# EAGLE design pH-meter-v1-1 (EAGLE 5.11)
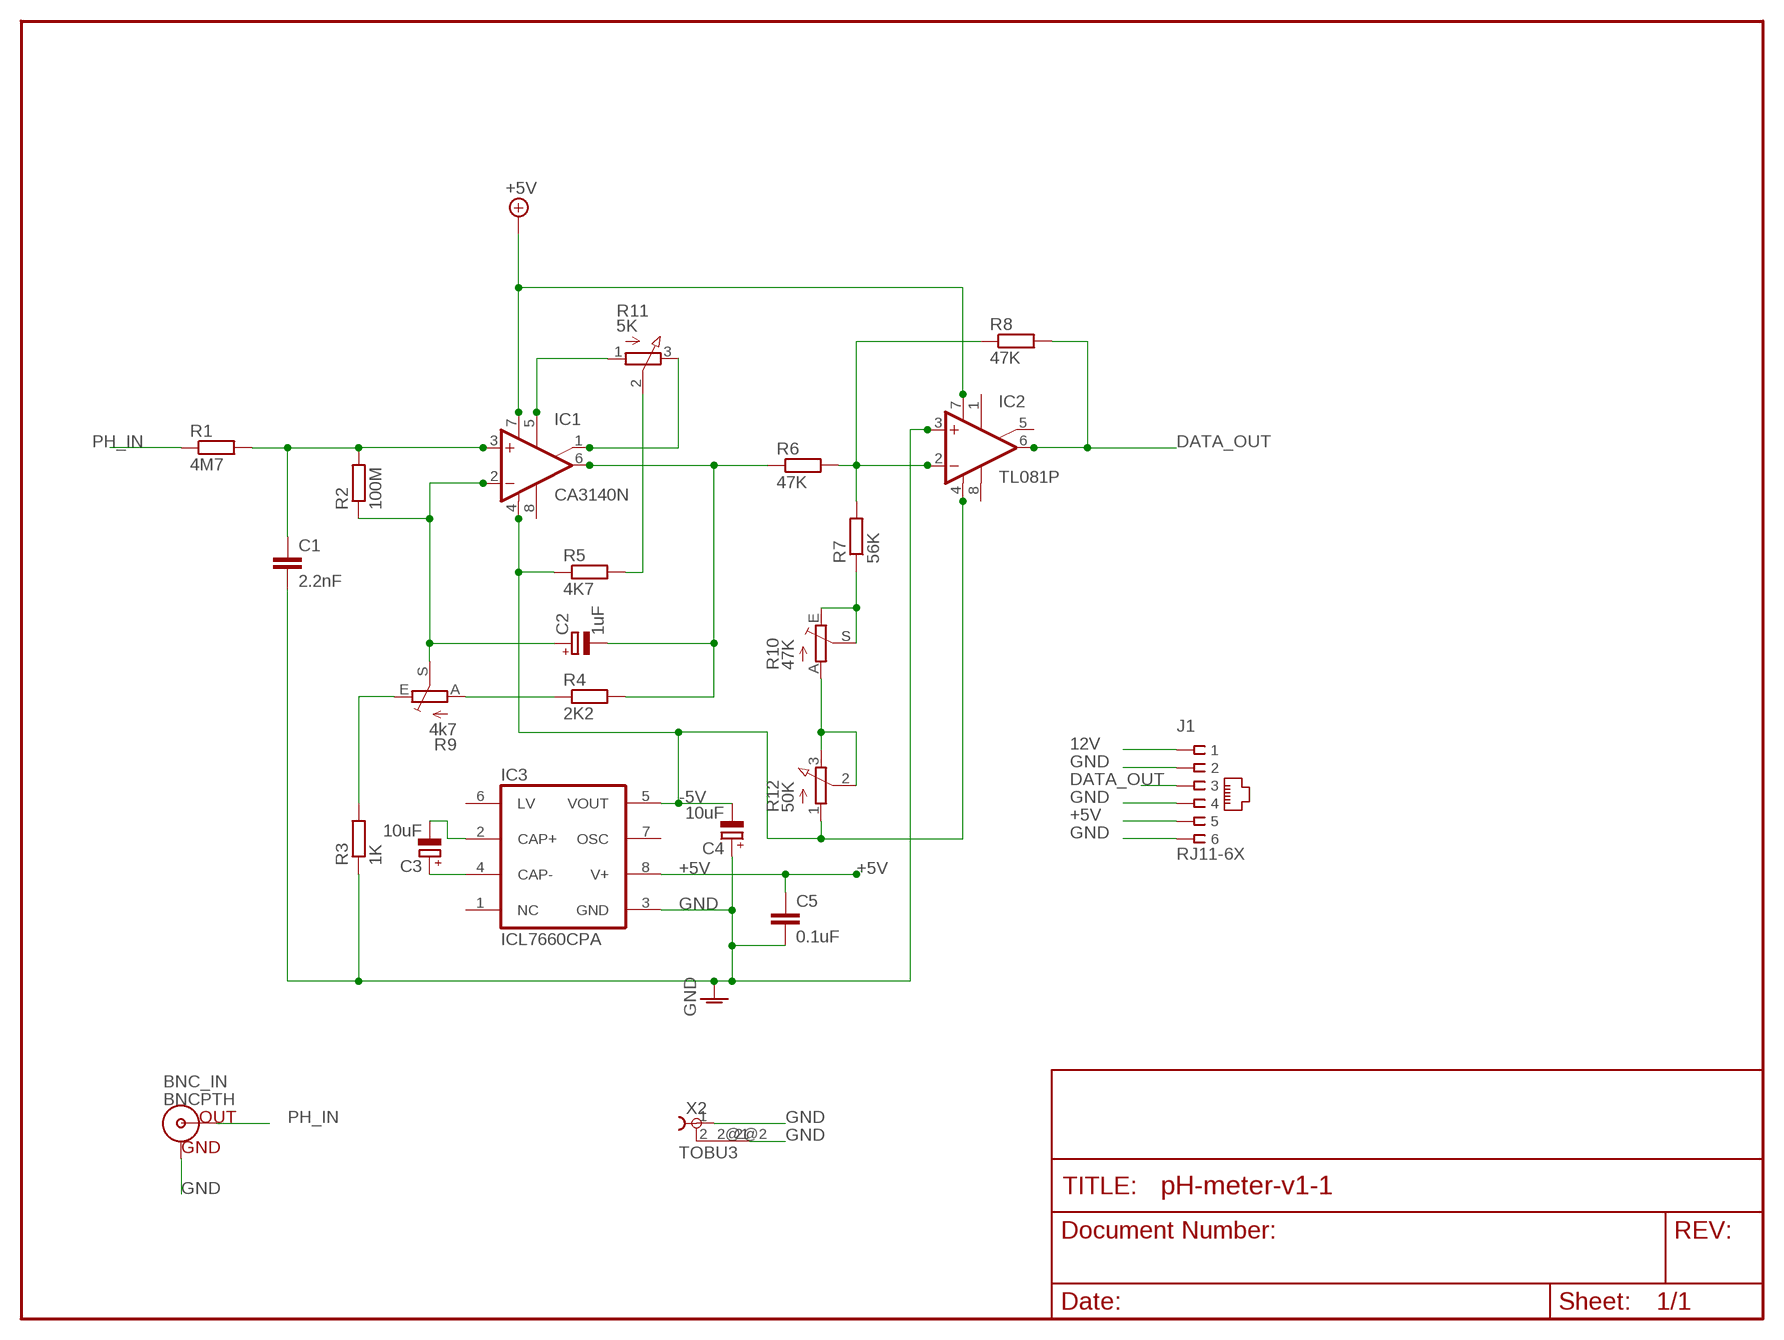
[diagram p0: schematic, sheet 1]

## Parts
BNC_IN  BNCPTH  [BNC]
C1  2.2nF  C-EU025-030X050  [C025-030X050]
C2  1uF  CPOL-EUE2-4  [E2-4]
C3  10uF  CPOL-EUE2-4  [E2-4]
C4  10uF  CPOL-EUE2-4  [E2-4]
C5  0.1uF  C-EU025-030X050  [C025-030X050]
IC1  CA3140N  [DIL08]
IC2  TL081P  [DIL08]
IC3  ICL7660CPA  [DIL08]
J1  RJ11-6X  [RJ11-NO_SHIELD]
R1  4M7  R-EU_0309/12  [0309/12]
R2  100M  R-EU_0309/12  [0309/12]
R3  1K  R-EU_0309/12  [0309/12]
R4  2K2  R-EU_0309/12  [0309/12]
R5  4K7  R-EU_0309/12  [0309/12]
R6  47K  R-EU_0309/12  [0309/12]
R7  56K  R-EU_0309/12  [0309/12]
R8  47K  R-EU_0309/12  [0309/12]
R9  4k7  TRIM_EU-LI15  [LI15]
R10  47K  TRIM_EU-LI15  [LI15]
R11  5K  3RP/1610N  [3RP/1610N]
R12  50K  3RP/1610N  [3RP/1610N]
X2  TOBU3  [TOBU3]

## Nets
12V: J1.1
+5V: C5.1 IC1.7(V+) IC2.7(V+) IC3.8(V+) J1.5
-5V: C4.- IC1.4(V-) IC2.4(V-) IC3.5(VOUT) R5.1 R12.1(A)
DATA_OUT: IC2.6(OUT) J1.3 R8.2
GND: BNC_IN.GND C1.2 C4.+ C5.2 IC2.3(+IN) IC3.3(GND) J1.2 J1.4 J1.6 R3.1 X2.1 X2.2@2
N$1: C1.1 IC1.3(+IN) R1.2 R2.2
N$2: C2.+ IC1.2(-IN) R2.1 R9.S
N$3: R5.2 R11.2(S)
N$4: IC1.5(ON) R11.1(A)
N$5: IC1.1(ON/CMP) R11.3(E)
N$6: C2.- IC1.6(OUT) R4.2 R6.1
N$7: R4.1 R9.A
N$8: R3.2 R9.E
N$9: R7.1 R10.E R10.S
N$10: R10.A R12.2(S) R12.3(E)
N$11: C3.- IC3.2(CAP+)
N$12: IC2.2(-IN) R6.2 R7.2 R8.1
N$13: C3.+ IC3.4(CAP-)
PH_IN: BNC_IN.S(OUT) R1.1
Unconnected: IC1.8(CMP) IC2.1(ON1) IC2.5(ON2) IC2.8(OPT) IC3.1(NC) IC3.6(LV) IC3.7(OSC) X2.2 X2.2@1

## Library data of the parts
BNC_IN = SparkFun:BNC: BNC Connector, Mouser Part# 5227161
C1 C5 = resistor:C-EU: CAPACITOR, European symbol
C2-C4 = resistor:CPOL-EU: POLARIZED CAPACITOR, European symbol
IC1 = linear:CA3140: OP AMP
IC2 = linear:TL081: OP AMP
IC3 = maxim:ICL7660CPA: VOLTAGE CONVERTER; MF: INTERSIL; MPN: ICL7660CPA; OC_FARNELL: 1018170; OC_NEWARK: 06F7441
J1 = con-tycoelectronics:RJ11: CORCOM Modular RJ Jacks No Shield Source: www.tycoelectronics.com .. ENG_DS_1654001_1099_RJ_L_0507.pdf; MPN: RJ11-6X; OC_FARNELL: unknown; OC_NEWARK: 16R6089
R1-R8 = rcl:R-EU_: RESISTOR, European symbol
R9 R10 = pot:TRIM_EU-: POTENTIOMETER
R11 R12 = pot:3RP/1610N: 16mm Potentiometer one level Source: http://www.alphapotentiometers.net/html/16mm_pot_2.html
X2 = con-hirschmann:TOBU3: Female Cinch CONNECTOR ( RCA Jack ); MF: FARNELL; MPN: TOBU 3; OC_FARNELL: 592791; OC_NEWARK: 06WX5914

## Board
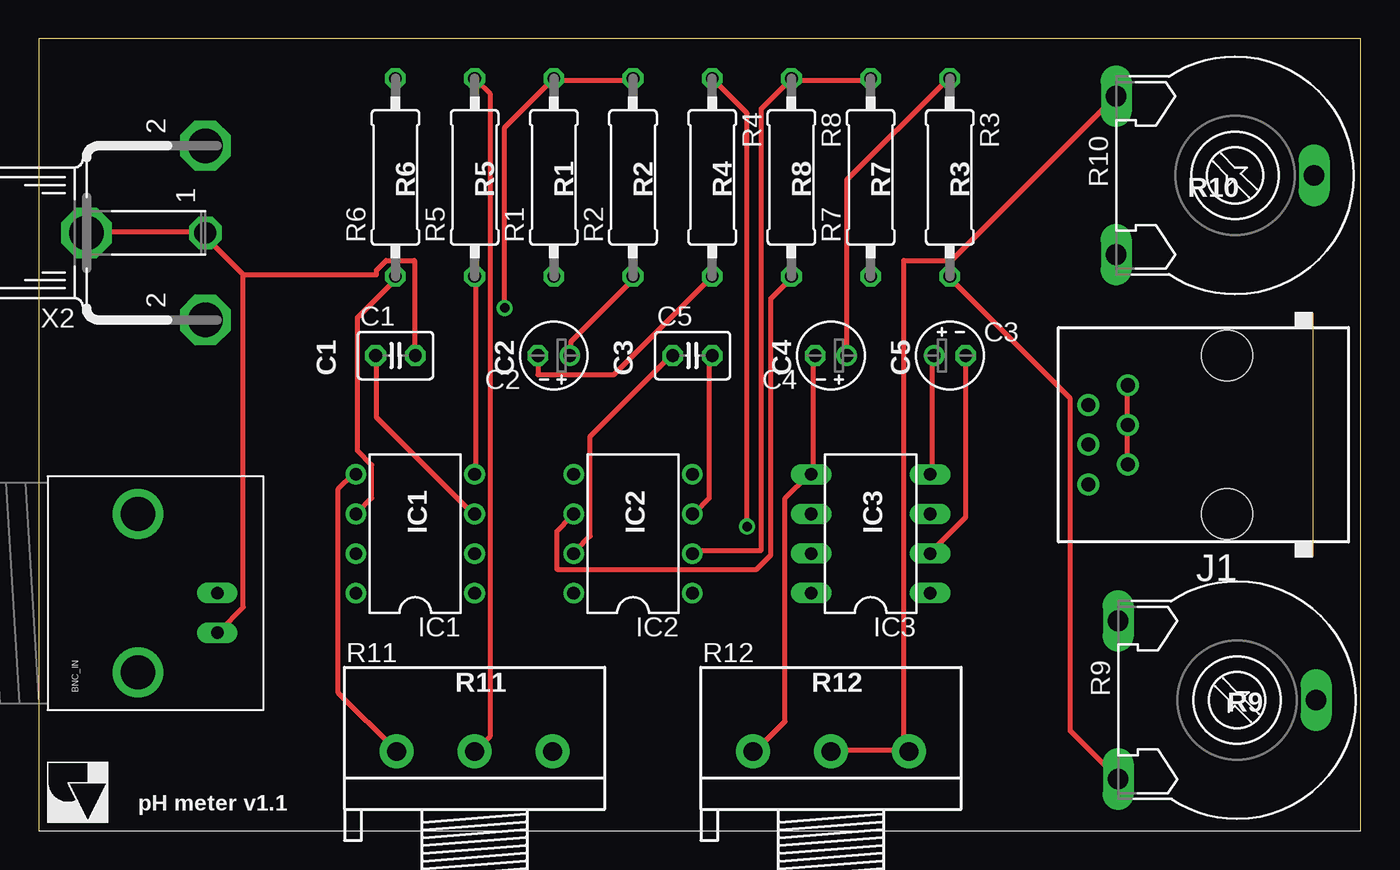
[diagram p1: board, top side]
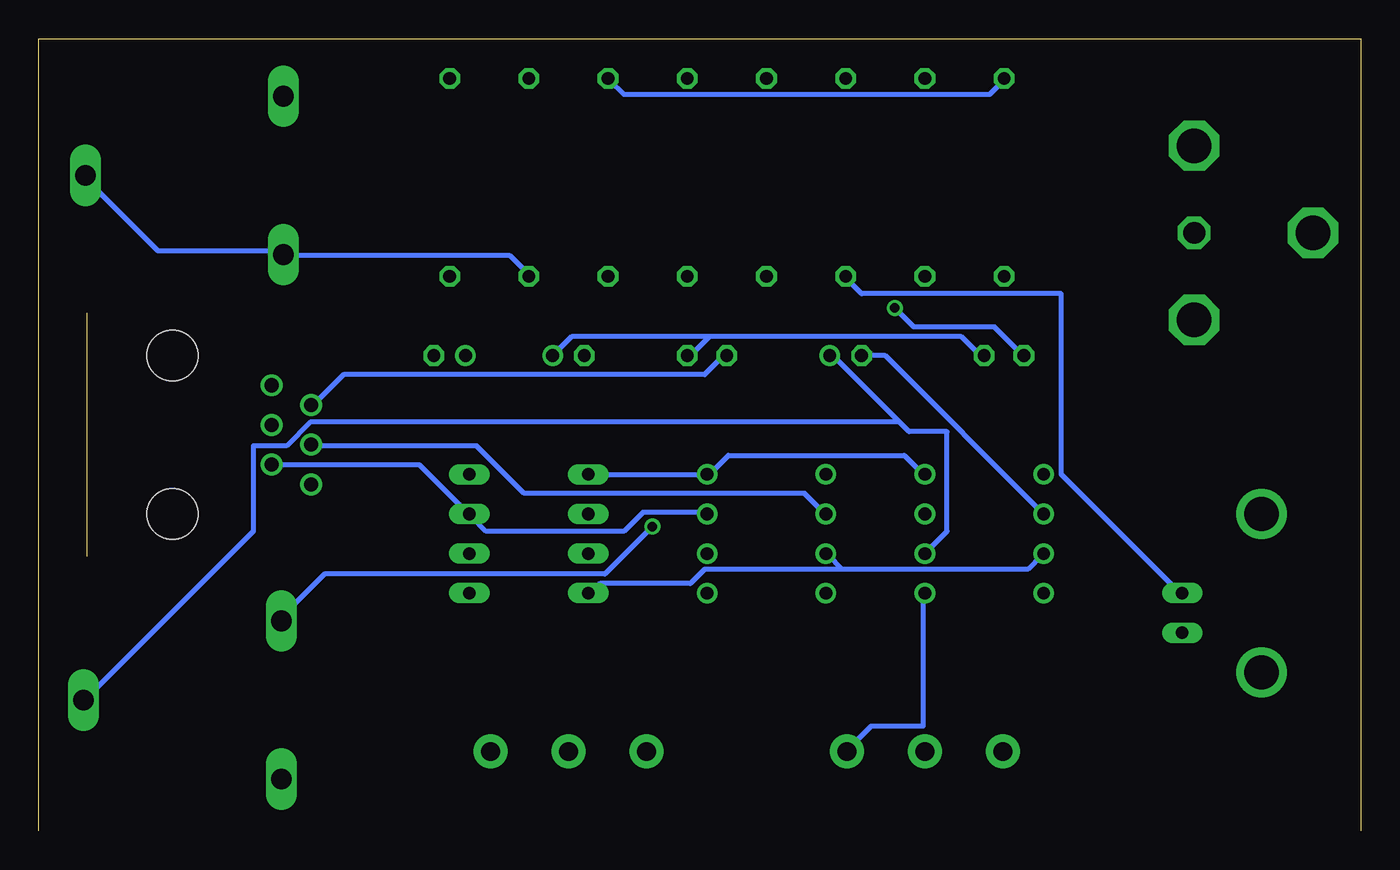
[diagram p2: board, bottom side, seen from below]

Size 84.76 x 50.79 mm. Coordinates in mm from the lower left corner, seen from the top.
Outline: 84.76,0 84.76,50.79 0,50.79 0,0
Copper layers (1*16): Top 0.035mm / dielectric 1.5mm / Bottom 0.035mm
Design rules "default *": minimum track width 12mil, minimum drill 24mil, track to track 8mil, track to pad 8mil, pad to pad 8mil, via to via 8mil, smd to smd 8mil, copper to edge 50mil, drill to drill 8mil, minimum pad ring 10mil, minimum via ring 8mil, stop-mask expansion 4mil, vias tented up to drill 0mil, thermal gap 10mil

### Footprints (pad centres in the part's own frame; a part is rotated, then mirrored left to right if it is on the bottom)
BNC = drill 2.2 round: 3 -5.08,5.08; 4 5.08,5.08 | drill 0.8 long: GND -2.54,0; S 0,0
C025-030X050 = drill 0.813 octagon: 1 -1.27,0; 2 1.27,0
E2-4 = drill 0.813 pad 1.27 round: + -1.016,0 | drill 0.813 pad 1.27 octagon: - 1.016,0
DIL08 = drill 0.813 pad 1.27 round: 1 -3.81,-3.81; 2 -1.27,-3.81; 3 1.27,-3.81; 4 3.81,-3.81; 5 3.81,3.81; 6 1.27,3.81; 7 -1.27,3.81; 8 -3.81,3.81
DIL08' = drill 0.813 long: 1 -3.81,-3.81; 2 -1.27,-3.81; 3 1.27,-3.81; 4 3.81,-3.81; 5 3.81,3.81; 6 1.27,3.81; 7 -1.27,3.81; 8 -3.81,3.81
RJ11-NO_SHIELD = drill 0.9 pad 1.4 round: 1 -3.175,8.89; 2 -1.905,6.35; 3 -0.635,8.89; 4 0.635,6.35; 5 1.905,8.89; 6 3.175,6.35 | hole 3.251: -5.08,0; 5.08,0
0309/12 = drill 0.813 octagon: 1 -6.35,0; 2 6.35,0
LI15 = drill 1.321 long: A -5.08,-7.62; E 5.08,-7.62; S 0,5.08
3RP/1610N = drill 1.2 pad 2.184 round: 1 -5,0; 2 0,0; 3 5,0
TOBU3 = drill 1.397 octagon: 1 0,-2.54 | drill 2.21 octagon: 2 5.588,-2.54; 2@1 -5.588,-2.54; 2@2 0,5.08

### Placement (x,y rotation side)
BNC_IN  11.43,15.24 90 top
C1  22.86,30.48 0 top
C2  33.02,30.48 180 top
C3  58.42,30.48 0 top
C4  50.8,30.48 180 top
C5  41.91,30.48 0 top
IC1  24.13,19.05 90 top
IC2  38.1,19.05 90 top
IC3  ICL7660CPA  [DIL08']  53.34,19.05 90 top
J1  76.2,25.4 90 top
R1  33.02,41.91 90 top
R2  38.1,41.91 90 top
R3  58.42,41.91 270 top
R4  43.18,41.91 270 top
R5  27.94,41.91 90 top
R6  22.86,41.91 90 top
R7  53.34,41.91 90 top
R8  48.26,41.91 270 top
R9  76.83,8.38 270 top
R10  76.71,42.04 270 top
R11  27.94,5.08 0 top
R12  50.8,5.08 0 top
X2  8.13,38.35 90 top

### Tracks (layer width: path | path; a pad name or v marks a point on that pad's centre or on a via)
+5V
  Top 0.305: C5.1 40.54,30.48 35.36,25.3 35.36,18.9 34.44,17.98 IC2.7
  Bottom 0.305: 33.22,16.76 21.34,16.76 20.42,17.68 IC1.7 | 33.22,16.76 34.14,17.68 IC2.7 | 33.22,16.76 42.06,16.76 42.98,15.85 48.77,15.85 49.38,15.24 IC3.8 | J1.5 67.06,27.43 65.23,29.26 42.06,29.26 40.84,30.48 C5.1
-5V
  Top 0.305: IC1.4 28.04,22.86 28.04,35.36 R5.1 | C4.- 49.68,30.48 49.68,22.86 IC3.5 49.38,22.86 47.85,21.34 47.85,7.01 46.02,5.18 R12.1
  Bottom 0.305: IC3.5 49.38,22.86 42.06,22.86 IC2.4 41.76,22.86 40.54,24.08 29.26,24.08 28.04,22.86 IC1.4
DATA_OUT
  Top 0.305: R8.2 48.16,35.36 46.94,34.14 46.94,17.68 46.02,16.76 33.22,16.76 33.22,19.2 34.14,20.12 IC2.6
  Bottom 0.305: IC2.6 34.44,20.42 35.66,21.64 53.65,21.64 56.69,24.69 67.06,24.69 J1.3
GND
  Top 0.305: 13.11,35.66 13.11,14.33 11.58,12.8 BNC_IN.GND | 13.11,35.66 10.67,38.1 X2.1 10.67,38.41 3.05,38.41 X2.2@2 | J1.6 69.8,28.35 69.8,26.21 J1.4 69.8,25.91 69.8,23.77 J1.2 | IC2.3 42.06,20.42 42.98,21.34 42.98,30.48 C5.2 | C4.+ 51.82,41.76 58.22,48.16 R3.1 | 13.11,35.66 21.64,35.66 21.64,35.97 22.25,36.58 24.08,36.58 24.08,30.48 C1.2
  Bottom 0.305: J1.2 69.8,23.47 60.35,23.47 57.3,20.42 IC3.3 57,20.12 56.08,19.2 47.24,19.2 46.02,20.42 42.06,20.42 IC2.3 | 41.76,31.7 25.6,31.7 24.38,30.48 C1.2 | 41.76,31.7 42.98,30.48 C5.2 | C4.+ 50.6,31.7 41.76,31.7
N$1  (via drill 0.61)
  Top 0.305: R2.2 38.1,48.16 33.22,48.16 R1.2 32.92,48.16 29.87,45.11 v29.87,33.53 | IC1.3 27.74,20.42 21.64,26.52 21.64,30.48 C1.1
  Bottom 0.305: v29.87,33.53 28.65,32.31 23.47,32.31 21.64,30.48 C1.1
N$2
  Top 0.305: R2.1 38.1,35.36 34.14,31.39 34.14,30.48 C2.+
  Bottom 0.305: 29.57,26.21 33.83,30.48 C2.+ | 29.57,26.21 28.96,25.6 26.52,25.6 26.52,19.2 27.74,17.98 IC1.2 | 29.57,26.21 67.36,26.21 68.89,24.69 71.02,24.69 71.02,19.2 81.69,8.53 R9.S
N$3
  Top 0.305: R5.2 28.04,48.16 28.96,47.24 28.96,6.1 28.04,5.18 R11.2
N$4
  Top 0.305: IC1.5 20.12,22.86 19.2,21.95 19.2,8.84 22.86,5.18 R11.1
N$5
  Bottom 0.305: IC1.1 28.04,15.24 28.04,6.71 31.39,6.71 32.92,5.18 R11.3
N$6
  Top 0.305: R6.1 22.86,35.36 20.42,32.92 20.42,24.38 21.34,23.47 21.34,21.34 20.42,20.42 IC1.6 | C2.- 32,29.26 36.88,29.26 42.98,35.36 R4.2
  Bottom 0.305: C2.- 30.48,30.48 20.42,20.42 IC1.6
N$7  (via drill 0.61)
  Top 0.305: v45.41,19.51 45.41,46.02 43.28,48.16 R4.1
  Bottom 0.305: v45.41,19.51 48.46,16.46 66.45,16.46 69.19,13.72 R9.A
N$8
  Top 0.305: R3.2 58.52,35.36 66.14,27.74 66.14,6.4 69.19,3.35 R9.E
N$9
  Bottom 0.305: R7.1 53.34,35.66 54.56,36.88 68.89,36.88 R10.E 69.19,37.19 77.11,37.19 81.69,41.76 R10.S
N$10
  Top 0.305: 55.47,5.49 55.47,36.58 58.52,36.58 68.89,46.94 R10.A | 55.47,5.49 55.78,5.18 R12.3 55.47,5.49 | 55.47,5.49 55.47,5.18 50.9,5.18 R12.2
N$11
  Top 0.305: C3.- 59.44,20.12 57.3,17.98 IC3.2
N$12
  Top 0.305: IC2.2 42.06,17.98 46.33,17.98 46.33,46.33 48.16,48.16 R8.1 48.46,48.16 53.34,48.16 R7.2
  Bottom 0.305: R6.2 22.86,48.16 23.77,47.24 47.24,47.24 48.16,48.16 R8.1
N$13
  Top 0.305: IC3.4 57.3,22.86 57.3,30.48 C3.+
PH_IN
  Bottom 0.305: BNC_IN.S 11.58,15.24 19.2,22.86 19.2,34.44 32,34.44 32.92,35.36 R1.1

### Text on the board
tPlace: R6 | R5 | R1 | R2 | R4 | R8 | R7 | R3 | R10 | C1 | C2 | C3 | C4 | C5 | IC1 | IC2 | IC3 | R11 | R12 | R9 | pH meter v1.1